# EAGLE design RAMPS (EAGLE 7.5.0)
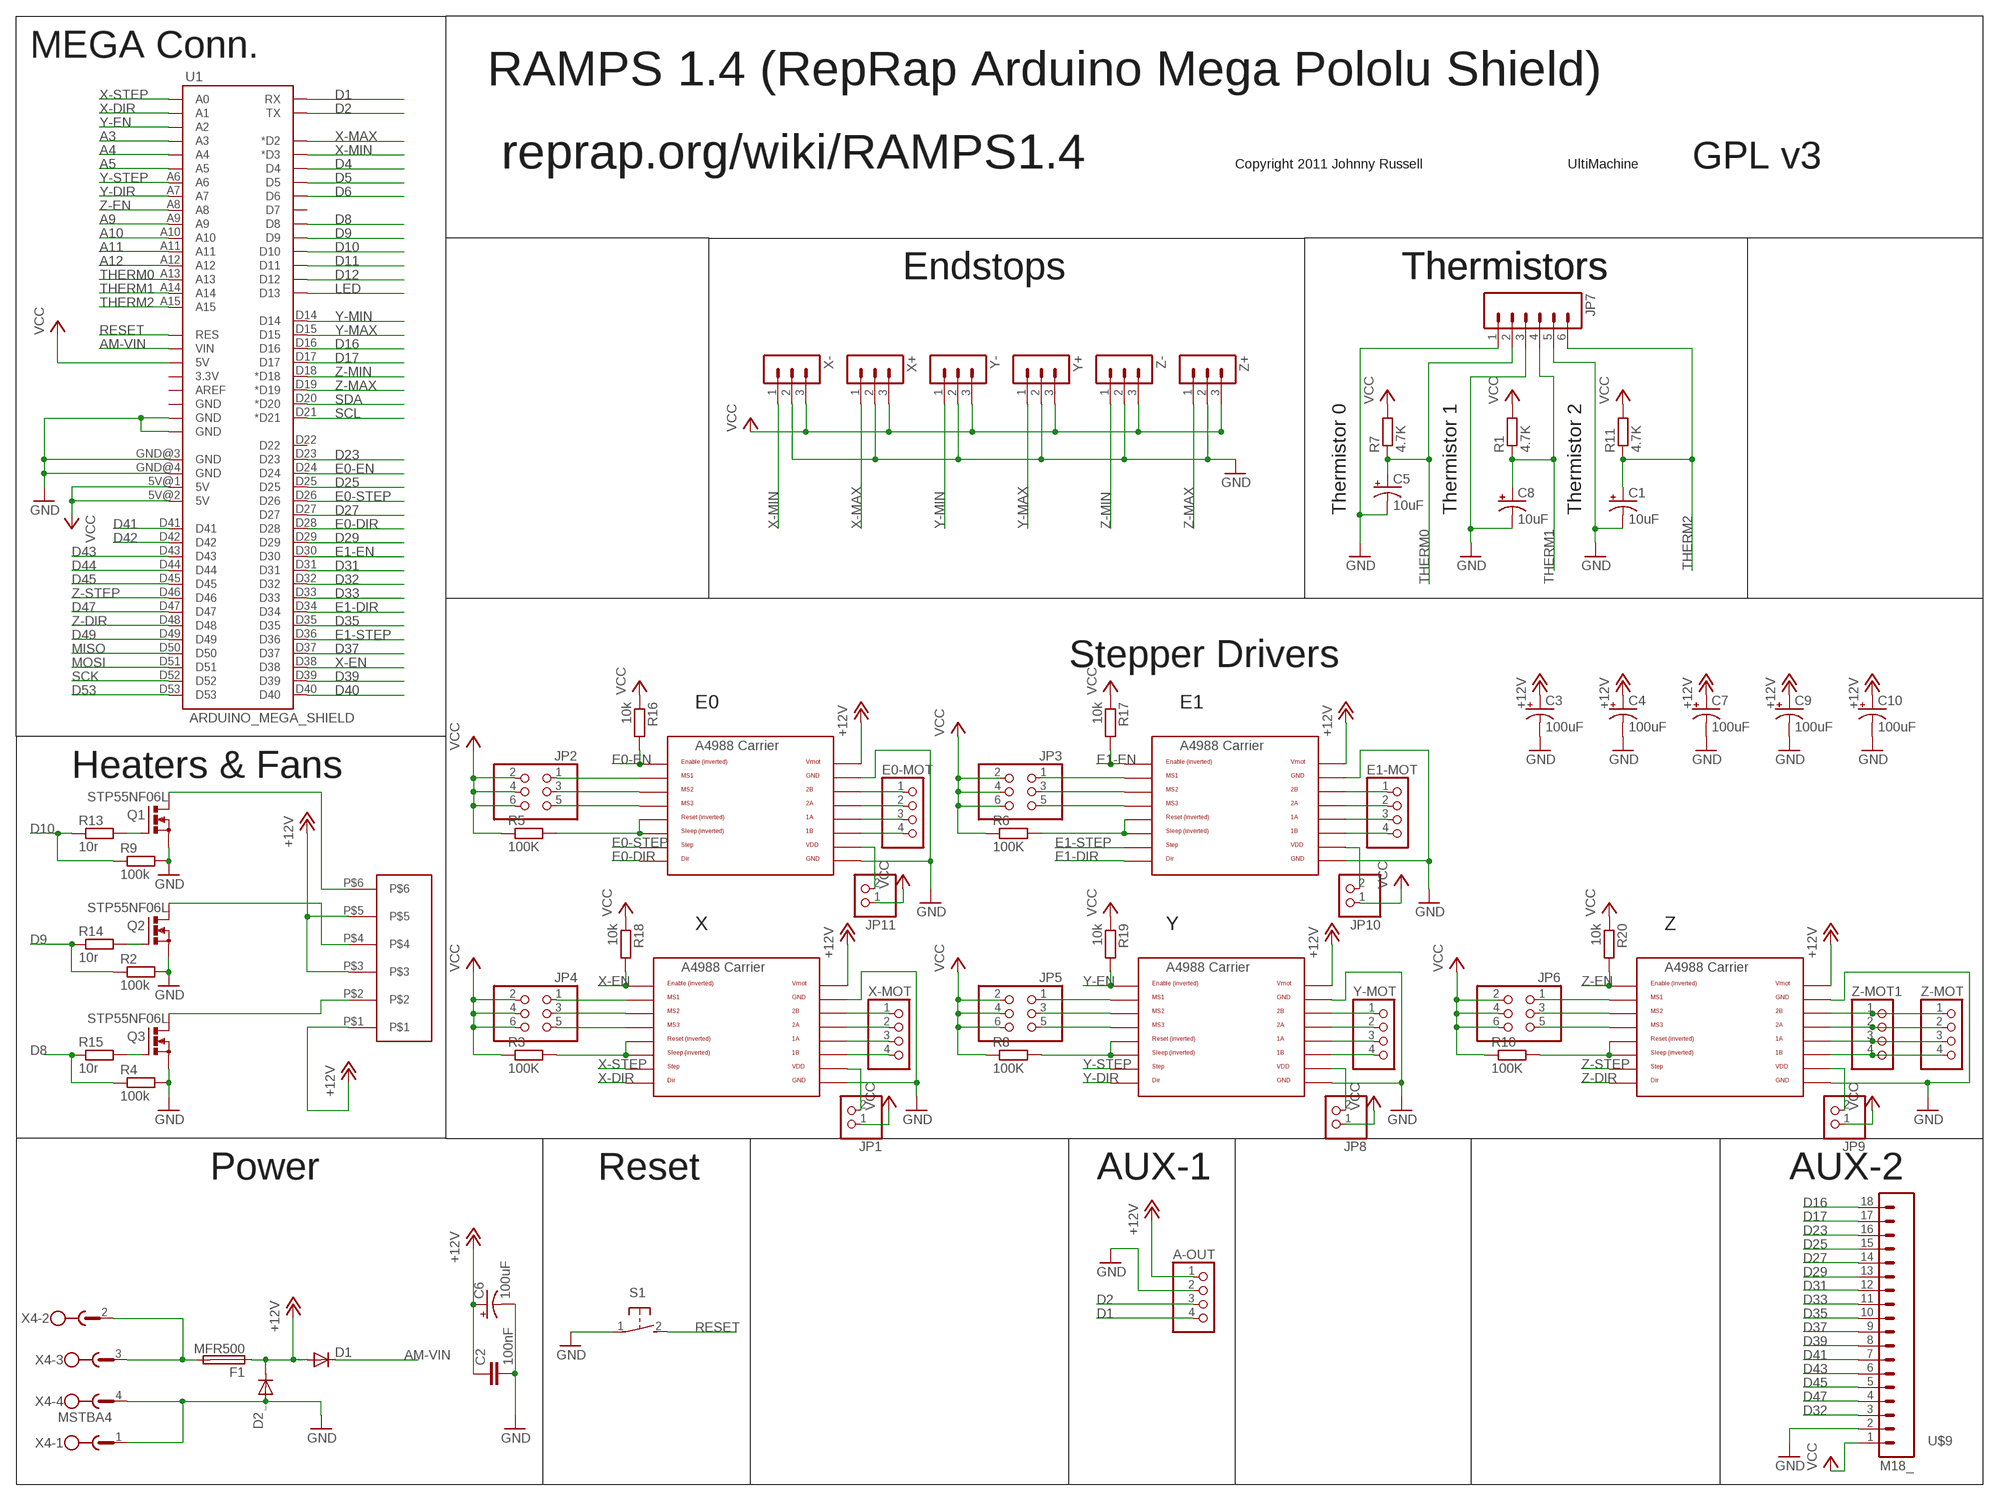
[diagram p0: schematic, sheet 1]

## Parts
A-OUT  PINHD-1X4  [1X04]
C1  10uF  CPOL-US153CLV-0405  [153CLV-0405]
C2  100nF  C-EUC0805  [C0805]
C3  100uF  CPOL-US153CLV-0605  [153CLV-0605]
C4  100uF  CPOL-US153CLV-0605  [153CLV-0605]
C5  10uF  CPOL-US153CLV-0405  [153CLV-0405]
C6  100uF  CPOL-US153CLV-0605  [153CLV-0605]
C7  100uF  CPOL-US153CLV-0605  [153CLV-0605]
C8  10uF  CPOL-US153CLV-0405  [153CLV-0405]
C9  100uF  CPOL-US153CLV-0605  [153CLV-0605]
C10  100uF  CPOL-US153CLV-0605  [153CLV-0605]
D1  DIODE-DO-214AC  [DO-214AC]
D2  DIODE-DO-214AC  [DO-214AC]
E0-MOT  PINHD-1X4  [1X04]
E1-MOT  PINHD-1X4  [1X04]
F1  MFR500  PTCFUSE  [MFR500]
JP1  PINHD-1X2  [1X02]
JP2  PINHD-2X3  [2X03]
JP3  PINHD-2X3  [2X03]
JP4  PINHD-2X3  [2X03]
JP5  PINHD-2X3  [2X03]
JP6  PINHD-2X3  [2X03]
JP7  M06SIP  [1X06]
JP8  PINHD-1X2  [1X02]
JP9  PINHD-1X2  [1X02]
JP10  PINHD-1X2  [1X02]
JP11  PINHD-1X2  [1X02]
Q1  STP55NF06L  IRF512  [TO220BV]
Q2  STP55NF06L  IRF512  [TO220BV]
Q3  STP55NF06L  IRF512  [TO220BV]
R1  4.7K  R-EU_R1206  [R1206]
R2  100k  R-EU_R0805  [R0805]
R3  100K  R-EU_R0805  [R0805]
R4  100k  R-EU_R0805  [R0805]
R5  100K  R-EU_R0805  [R0805]
R6  100K  R-EU_R0805  [R0805]
R7  4.7K  R-EU_R1206  [R1206]
R8  100K  R-EU_R0805  [R0805]
R9  100k  R-EU_R0805  [R0805]
R10  100K  R-EU_R0805  [R0805]
R11  4.7K  R-EU_R1206  [R1206]
R13  10r  R-EU_R0805  [R0805]
R14  10r  R-EU_R0805  [R0805]
R15  10r  R-EU_R0805  [R0805]
R16  10k  R-EU_R0805  [R0805]
R17  10k  R-EU_R0805  [R0805]
R18  10k  R-EU_R0805  [R0805]
R19  10k  R-EU_R0805  [R0805]
R20  10k  R-EU_R0805  [R0805]
S1  31-XX  [B3F-31XX]
U1  ARDUINO_MEGA_SHIELD  [ARDUINO_MEGA_SHIELD]
U$2  282837-6  [282837-6]
U$4  A4988BREAKOUT  [A4988BREAKOUT]
U$5  A4988BREAKOUT  [A4988BREAKOUT]
U$6  A4988BREAKOUT  [A4988BREAKOUT]
U$7  A4988BREAKOUT  [A4988BREAKOUT]
U$8  A4988BREAKOUT  [A4988BREAKOUT]
U$9  M18_  [1X18]
X4  MSTBA4  [MSTBA4]
X+  3PIN-HEADER  [3PIN-HEADER]
X-  3PIN-HEADER  [3PIN-HEADER]
X-MOT  PINHD-1X4  [1X04]
Y+  3PIN-HEADER  [3PIN-HEADER]
Y-  3PIN-HEADER  [3PIN-HEADER]
Y-MOT  PINHD-1X4  [1X04]
Z+  3PIN-HEADER  [3PIN-HEADER]
Z-  3PIN-HEADER  [3PIN-HEADER]
Z-MOT  PINHD-1X4  [1X04]
Z-MOT1  PINHD-1X4  [1X04]

## Nets
+12V: A-OUT.1 C2.1 C3.+ C4.+ C6.+ C7.+ C9.+ C10.+ D1.A D2.C F1.1 U$2.P$1 U$2.P$3 U$2.P$5 U$4.VMOT U$5.VMOT U$6.VMOT U$7.VMOT U$8.VMOT
A3: U1.A3
A4: U1.A4
A5: U1.A5
A9: U1.A9
A10: U1.A10
A11: U1.A11
A12: U1.A12
AM-VIN: D1.C U1.VIN
D1: A-OUT.4 U1.RX
D2: A-OUT.3 U1.TX
D4: U1.D4
D5: U1.D5
D6: U1.D6
D8: R4.1 R15.1 U1.D8
D9: R2.1 R14.1 U1.D9
D10: R9.1 R13.1 U1.D10
D11: U1.D11
D12: U1.D12
D16: U1.D16 U$9.18
D17: U1.D17 U$9.17
D23: U1.D23 U$9.16
D25: U1.D25 U$9.15
D27: U1.D27 U$9.14
D29: U1.D29 U$9.13
D31: U1.D31 U$9.12
D32: U1.D32 U$9.3
D33: U1.D33 U$9.11
D35: U1.D35 U$9.10
D37: U1.D37 U$9.9
D39: U1.D39 U$9.8
D40: U1.D40
D41: U1.D41 U$9.7
D42: U1.D42
D43: U1.D43 U$9.6
D44: U1.D44
D45: U1.D45 U$9.5
D47: U1.D47 U$9.4
D49: U1.D49
D53: U1.D53
E0-DIR: U1.D28 U$4.DIR
E0-EN: R16.2 U1.D24 U$4.EN
E0-STEP: U1.D26 U$4.STEP
E1-DIR: U1.D34 U$5.DIR
E1-EN: R17.2 U1.D30 U$5.EN
E1-STEP: U1.D36 U$5.STEP
GND: A-OUT.2 C1.- C2.2 C3.- C4.- C5.- C6.- C7.- C8.- C9.- C10.- D2.A JP7.1 JP7.3 JP7.5 Q1.S Q2.S Q3.S R2.2 R4.2 R9.2 S1.1(P) U1.GND@0(GND) U1.GND@1(GND) U1.GND@3(GND) U1.GND@4(GND) U$4.GND U$4.GND@0(GND) U$5.GND U$5.GND@0(GND) U$6.GND U$6.GND@0(GND) U$7.GND U$7.GND@0(GND) U$8.GND U$8.GND@0(GND) U$9.2 X4.1 X4.4 X+.2 X-.2 Y+.2 Y-.2 Z+.2 Z-.2
LED: U1.D13
MISO: U1.D50
MOSI: U1.D51
N$1: Q2.D U$2.P$4
N$2: F1.2 X4.2 X4.3
N$3: E0-MOT.1 U$4.2B
N$4: E0-MOT.2 U$4.2A
N$5: JP2.1 U$4.MS1
N$6: JP2.5 U$4.MS3
N$7: Q1.D U$2.P$6
N$8: R5.2 U$4.RST U$4.SLP(SLEEP)
N$9: JP2.3 U$4.MS2
N$10: E0-MOT.3 U$4.1A
N$11: E0-MOT.4 U$4.1B
N$12: E1-MOT.1 U$5.2B
N$13: E1-MOT.2 U$5.2A
N$14: JP4.1 U$6.MS1
N$15: JP4.3 U$6.MS2
N$16: E1-MOT.3 U$5.1A
N$17: JP5.3 U$7.MS2
N$18: E1-MOT.4 U$5.1B
N$19: JP4.5 U$6.MS3
N$20: R3.2 U$6.RST U$6.SLP(SLEEP)
N$21: U$6.2B X-MOT.1
N$22: U$6.2A X-MOT.2
N$23: R8.2 U$7.RST U$7.SLP(SLEEP)
N$24: R6.2 U$5.RST U$5.SLP(SLEEP)
N$25: JP3.1 U$5.MS1
N$26: U$6.1A X-MOT.3
N$27: U$6.1B X-MOT.4
N$28: U$7.2B Y-MOT.1
N$29: U$7.2A Y-MOT.2
N$30: U$7.1A Y-MOT.3
N$31: JP5.5 U$7.MS3
N$32: JP11.2 U$4.VDD
N$33: JP5.1 U$7.MS1
N$34: JP3.5 U$5.MS3
N$35: JP3.3 U$5.MS2
N$36: U$7.1B Y-MOT.4
N$37: JP6.3 U$8.MS2
N$38: R10.2 U$8.RST U$8.SLP(SLEEP)
N$39: JP6.5 U$8.MS3
N$40: JP6.1 U$8.MS1
N$41: U$8.2B Z-MOT1.1 Z-MOT.1
N$42: U$8.2A Z-MOT1.2 Z-MOT.2
N$43: U$8.1A Z-MOT1.3 Z-MOT.3
N$44: U$8.1B Z-MOT1.4 Z-MOT.4
N$45: JP1.2 U$6.VDD
N$46: JP8.2 U$7.VDD
N$47: Q2.G R14.2
N$48: Q1.G R13.2
N$49: Q3.G R15.2
N$50: JP9.2 U$8.VDD
N$51: Q3.D U$2.P$2
N$52: JP10.2 U$5.VDD
RESET: S1.2(S) U1.RES
SCK: U1.D52
SCL: U1.D21(*D21)
SDA: U1.D20(*D20)
THERM0: C5.+ JP7.2 R7.1 U1.A13
THERM1: C8.+ JP7.4 R1.1 U1.A14
THERM2: C1.+ JP7.6 R11.1 U1.A15
VCC: JP1.1 JP2.2 JP2.4 JP2.6 JP3.2 JP3.4 JP3.6 JP4.2 JP4.4 JP4.6 JP5.2 JP5.4 JP5.6 JP6.2 JP6.4 JP6.6 JP8.1 JP9.1 JP10.1 JP11.1 R1.2 R3.1 R5.1 R6.1 R7.2 R8.1 R10.1 R11.2 R16.1 R17.1 R18.1 R19.1 R20.1 U1.5V@0(5V) U1.5V@1(5V) U1.5V@2(5V) U$9.1 X+.3 X-.3 Y+.3 Y-.3 Z+.3 Z-.3
X-DIR: U1.A1 U$6.DIR
X-EN: R18.2 U1.D38 U$6.EN
X-MAX: U1.D2(*D2) X+.1
X-MIN: U1.D3(*D3) X-.1
X-STEP: U1.A0 U$6.STEP
Y-DIR: U1.A7 U$7.DIR
Y-EN: R19.2 U1.A2 U$7.EN
Y-MAX: U1.D15 Y+.1
Y-MIN: U1.D14 Y-.1
Y-STEP: U1.A6 U$7.STEP
Z-DIR: U1.D48 U$8.DIR
Z-EN: R20.2 U1.A8 U$8.EN
Z-MAX: U1.D19(*D19) Z+.1
Z-MIN: U1.D18(*D18) Z-.1
Z-STEP: U1.D46 U$8.STEP
Unconnected: U1.3.3V U1.AREF U1.D7 U1.D22 U1.GND@2(GND)

## Notes on the sheet
- MEGA Conn.
- RAMPS 1.4 (RepRap Arduino Mega Pololu Shield)
- reprap.org/wiki/RAMPS1.4 | Copyright 2011 Johnny Russell | UltiMachine | GPL v3
- Endstops | Thermistors | Thermistors
- Thermistor 0 | Thermistor 1 | Thermistor 2
- Stepper Drivers
- E0 | E1
- Heaters & Fans
- X | Y | Z
- Power | Reset | AUX-1 | AUX-2

## Library data of the parts
A-OUT E0-MOT E1-MOT X-MOT Y-MOT Z-MOT Z-MOT1 = RepRapjr:PINHD-1X4: PIN HEADER
C1 C3-C10 = adafruit:CPOL-US: POLARIZED CAPACITOR, American symbol
C2 = rcl:C-EU: CAPACITOR, European symbol
D1 D2 = diode:DIODE-: DIODE
F1 = RepRapjr:PTCFUSE: LITTLEFUSE Picofuse/slow Littlefuse
JP1 JP8-JP11 = pinhead:PINHD-1X2: PIN HEADER
JP2-JP6 = pinhead:PINHD-2X3: PIN HEADER
JP7 = SparkFun:M06: Header 6 Standard 6-pin 0.1" header. Use with straight break away headers (SKU : PRT-00116), right angle break away headers (PRT-00553), swiss pins (PRT-00743), machine pins (PRT-00117), and female headers (PRT-00115). Molex polarized connector foot print use with SKU : PRT-08094 with associated crimp pins and housings. NOTES ON THE VARIANTS LOCK and LOCK_LONGPADS... This footprint was designed to help hold the alignment of a through-hole component (i.e. 6-pin header) while soldering it into place. You may notice that each hole has been shifted either up or down by 0.005 of an inch from it's more standard position (which is a perfectly straight line). This slight alteration caused the pins (the squares in the middle) to touch the edges of the holes. Because they are alternating, it causes a "brace" to hold the component in place. 0.005 has proven to be the perfect amount of "off-center" position when using our standard breakaway headers. Although looks a little odd when you look at the bare footprint, once you have a header in there, the alteration is very hard to notice. Also, if you push a header all the way into place, it is covered up entirely on the bottom side. This idea of altering the position of holes to aid alignment will be further integrated into the Sparkfun Library for other footprints. It can help hold any component with 3 or more connection pins.
Q1-Q3 = transistor-power:IRF512: N-CHANNEL MOS FET
R1-R11 R13-R20 = rcl:R-EU_: RESISTOR, European symbol
S1 = switch-omron:31-XX: OMRON SWITCH; MPN: B3F-3100; OC_FARNELL: 959704; OC_NEWARK: 36M3582
U1 = RepRapjr:ARDUINO_MEGA_SHIELD
U$2 = RepRapjr:282837-6
U$4-U$8 = RepRapjr:A4988BREAKOUT
U$9 = SparkFun:M18
X4 = con-phoenix-508:MSTBA4: PHOENIX
X+ X- Y+ Y- Z+ Z- = ultimachine:3PIN-HEADER: PIN HEADER

## Board
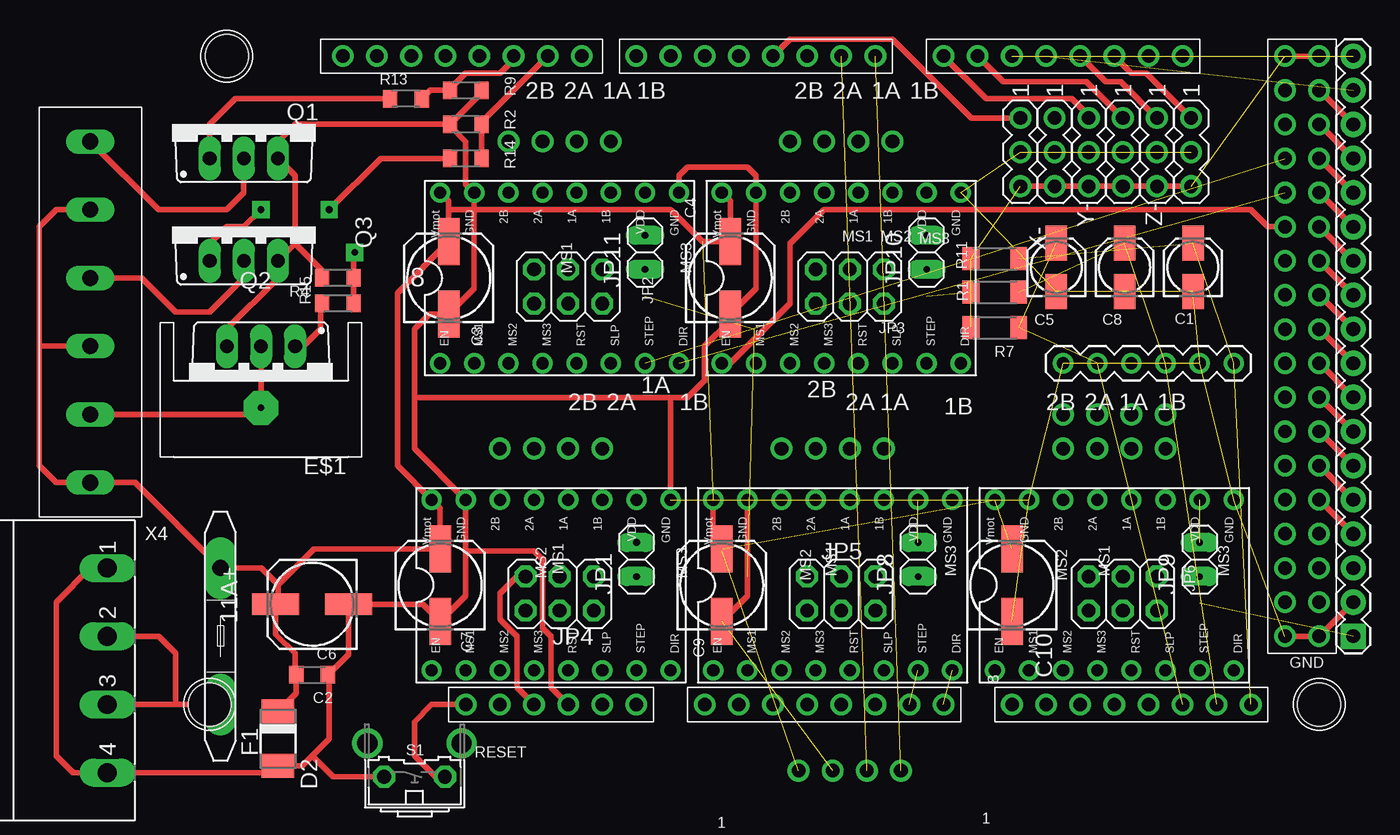
[diagram p1: board, top side]
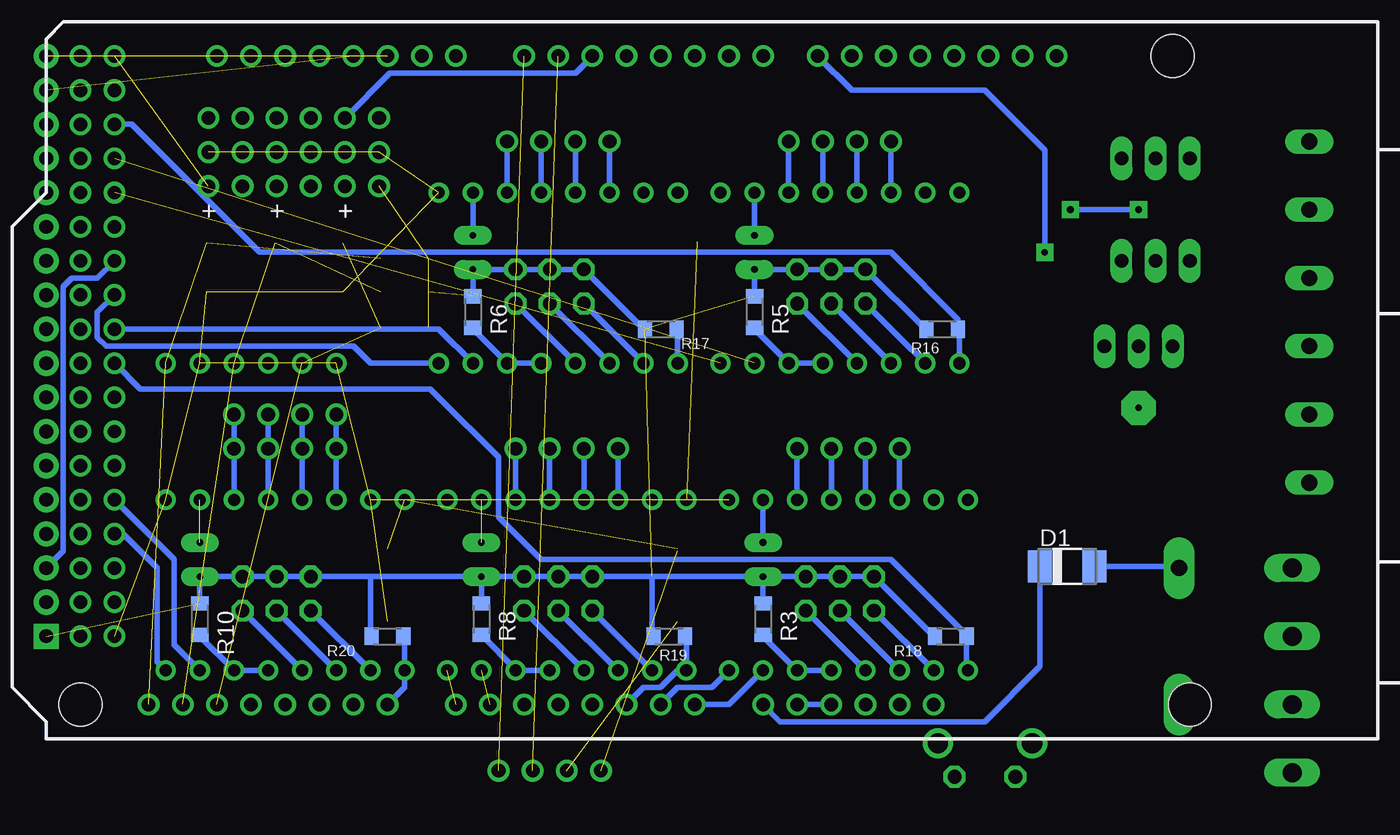
[diagram p2: board, bottom side, seen from below]

No outline drawn. Coordinates in mm, seen from the top.
Copper layers (1*16): Top 0.035mm / dielectric 1.5mm / Bottom 0.035mm
Design rules "GoldPhoenix": minimum track width 7mil, minimum drill 15mil, track to track 7mil, track to pad 7mil, pad to pad 7mil, via to via 7mil, smd to smd 7mil, copper to edge 10mil, drill to drill 8mil, minimum pad ring 12mil, minimum via ring 7mil, stop-mask expansion 4mil, vias tented up to drill 25mil, thermal gap 10mil

### Footprints (pad centres in the part's own frame; a part is rotated, then mirrored left to right if it is on the bottom)
1X04 = drill 1.016: 1 -2.54,0; 2 0,0; 3 2.54,0; 4 5.08,0
153CLV-0405 = smd 2.6 x 1.6: + 1.8,0; - -1.8,0
C0805 = smd 1.05 x 1.3: 1 -1.175,0; 2 1.175,0
153CLV-0605 = smd 3.5 x 1.6: + 2.7,0; - -2.7,0
DO-214AC = smd 1.8 x 2.4: A 2.025,0; C -2.025,0
SK95-3M3 = drill 0.5 pad 2.54 octagon: P$1 0,2.05
MFR500 = drill 1.2 pad 2.3 long: 1 -5.08,0; 2 5.08,0
1X02 = drill 0.5 pad 1.422 long: 1 -1.27,0; 2 1.27,0
2X03 = drill 1.016 octagon: 1 -2.54,-1.27; 2 -2.54,1.27; 3 0,-1.27; 4 0,1.27; 5 2.54,-1.27; 6 2.54,1.27
1X06 = drill 0.9 pad 1.422: 1 0,0; 2 2.54,0; 3 5.08,0; 4 7.62,0; 5 10.16,0; 6 12.7,0
TO220BV = drill 1.016 long: D 0,-2.54; G -2.54,-2.54; S 2.54,-2.54
R1206 = smd 1.25 x 1.7: 1 -1.775,0; 2 1.775,0
R0805 = smd 1.05 x 1.3: 1 -1.175,0; 2 1.175,0
B3F-31XX = drill 1.016 octagon: 1 -2.261,-1.245; 2 2.261,-1.245 | drill 1.499 pad 2.159: 3 -3.505,1.245; 4 3.505,1.245
ARDUINO_MEGA_SHIELD = drill 1 pad 1.422: 3.3V 35.56,2.54; 5V@0 38.1,2.54; 5V@1 93.98,50.8; 5V@2 96.52,50.8; A0 50.8,2.54; A1 53.34,2.54; A2 55.88,2.54; A3 58.42,2.54; A4 60.96,2.54; A5 63.5,2.54; A6 66.04,2.54; A7 68.58,2.54; A8 73.66,2.54; A9 76.2,2.54; A10 78.74,2.54; A11 81.28,2.54; A12 83.82,2.54; A13 86.36,2.54; A14 88.9,2.54; A15 91.44,2.54; AREF 23.876,50.8; D2 58.42,50.8; D3 55.88,50.8; D4 53.34,50.8; D5 50.8,50.8; D6 48.26,50.8; D7 45.72,50.8; D8 41.656,50.8; D9 39.116,50.8; D10 36.576,50.8; D11 34.036,50.8; D12 31.496,50.8; D13 28.956,50.8; D14 68.58,50.8; D15 71.12,50.8; D16 73.66,50.8; D17 76.2,50.8; D18 78.74,50.8; D19 81.28,50.8; D20 83.82,50.8; D21 86.36,50.8; D22 93.98,48.26; D23 96.52,48.26; D24 93.98,45.72; D25 96.52,45.72; D26 93.98,43.18; D27 96.52,43.18; D28 93.98,40.64; D29 96.52,40.64; D30 93.98,38.1; D31 96.52,38.1; D32 93.98,35.56; D33 96.52,35.56; D34 93.98,33.02; D35 96.52,33.02; D36 93.98,30.48; D37 96.52,30.48; D38 93.98,27.94; D39 96.52,27.94; D40 93.98,25.4; D41 96.52,25.4; D42 93.98,22.86; D43 96.52,22.86; D44 93.98,20.32; D45 96.52,20.32; D46 93.98,17.78; D47 96.52,17.78; D48 93.98,15.24; D49 96.52,15.24; D50 93.98,12.7; D51 96.52,12.7; D52 93.98,10.16; D53 96.52,10.16; GND@0 40.64,2.54; GND@1 43.18,2.54; GND@2 26.416,50.8; GND@3 93.98,7.62; GND@4 96.52,7.62; RES 33.02,2.54; RX 63.5,50.8; TX 60.96,50.8; VIN 45.72,2.54 | hole 3.2: 96.52,2.54; 13.97,2.54; 15.24,50.8
282837-6 = drill 1.2 long: P$1 0,-12.7; P$2 0,-7.62; P$3 0,-2.54; P$4 0,2.54; P$5 0,7.62; P$6 0,12.7
A4988BREAKOUT = drill 0.9: 1A 8.89,1.27; 1B 11.43,1.27; 2A 6.35,1.27; 2B 3.81,1.27; DIR 16.51,-11.43; EN -1.27,-11.43; GND 16.51,1.27; GND@0 1.27,1.27; MS1 1.27,-11.43; MS2 3.81,-11.43; MS3 6.35,-11.43; RST 8.89,-11.43; SLP 11.43,-11.43; STEP 13.97,-11.43; VDD 13.97,1.27; VMOT -1.27,1.27
1X18 = drill 1.016 pad 1.88 square: 1 0,0 | drill 1.016 pad 1.88: 2 2.54,0; 3 5.08,0; 4 7.62,0; 5 10.16,0; 6 12.7,0; 7 15.24,0; 8 17.78,0; 9 20.32,0; 10 22.86,0; 11 25.4,0; 12 27.94,0; 13 30.48,0; 14 33.02,0; 15 35.56,0; 16 38.1,0; 17 40.64,0; 18 43.18,0
MSTBA4 = drill 1.397 long: 1 -7.62,5.08; 2 -2.54,5.08; 3 2.54,5.08; 4 7.62,5.08
3PIN-HEADER = drill 1.016: 1 -2.54,0; 2 0,0; 3 2.54,0

### Placement (x,y rotation side)
A-OUT  60.33,12.86 0 top
C1  87.12,50.32 90 top
C2  21.59,20 0 top
C3  31.75,49.53 90 top
C4  52.7,49.53 90 top
C5  76.96,50.32 90 top
C6  21.59,25.24 180 top
C7  31.11,26.67 90 top
C8  82.04,50.32 90 top
C9  52.07,26.67 90 top
C10  73.66,26.67 90 top
D1  23.09,28.07 0 bottom
D2  19.05,15.24 270 top
E0-MOT  38.73,59.69 0 top
E1-MOT  59.69,59.69 0 top
E$1  [SK95-3M3]  17.78,41.91 180 top
F1  14.76,22.86 270 top
JP1  45.72,28.57 90 top
JP2  40.64,48.9 0 top
JP3  61.59,48.9 0 top
JP4  40.01,26.04 0 top
JP5  60.96,26.04 0 top
JP6  81.92,26.04 0 top
JP7  77.47,43.18 0 top
JP8  66.67,28.57 90 top
JP9  87.63,28.57 90 top
JP10  67.31,51.44 90 top
JP11  46.35,51.44 90 top
Q1  16.51,60.96 0 top
Q2  16.51,53.34 0 top
Q3  17.78,41.91 180 top
R1  72.39,48.47 180 top
R2  33.02,60.96 180 top
R3  45.72,24.13 270 bottom
R4  23.5,49.53 180 top
R5  46.35,46.99 270 bottom
R6  67.31,46.99 270 bottom
R7  72.39,45.83 180 top
R8  66.67,24.13 270 bottom
R9  33.02,63.5 0 top
R10  87.63,24.13 270 bottom
R11  72.39,50.96 180 top
R13  28.57,62.87 180 top
R14  33.02,58.42 180 top
R15  23.5,47.62 180 top
R16  32.38,45.72 0 bottom
R17  53.34,45.72 0 bottom
R18  31.75,22.86 0 bottom
R19  52.7,22.86 0 bottom
R20  73.66,22.86 0 bottom
S1  29.21,13.65 0 top
U1  0,15.24 0 top
U$2  5.08,46.99 0 top
U$4  32.38,54.61 0 top
U$5  53.34,54.61 0 top
U$6  31.75,31.75 0 top
U$7  52.7,31.75 0 top
U$8  73.66,31.75 0 top
U$9  99.06,22.86 90 top
X4  1.27,20.32 270 top
X+  76.83,58.9 270 top
X-  74.3,58.9 270 top
X-MOT  38.1,36.83 0 top
Y+  81.92,58.9 270 top
Y-  79.38,58.9 270 top
Y-MOT  59.05,36.83 180 bottom
Z+  87,58.9 270 top
Z-  84.45,58.9 270 top
Z-MOT  80.01,39.37 0 top
Z-MOT1  80.01,36.83 0 top

### Tracks (layer width: path | path; a pad name or v marks a point on that pad's centre or on a via)
+12V  (4 unrouted)
  Top 0.406: 1.27,44.45 1.27,35.56 2.54,34.29 U$2.P$1 8.41,34.29 F1.1 17.78,27.94 19.05,26.67 | 1.27,44.45 2.54,44.45 U$2.P$3 | U$2.P$5 2.54,54.61 1.27,53.34 1.27,44.45 | U$4.VMOT 31.75,55.24 31.75,54.61 | 31.75,54.61 C3.+ | C3.+ 31.75,52.07 C3.+ | U$5.VMOT 52.7,55.24 C4.+ 50.64,52.23 48.26,54.61 31.75,54.61 | C9.+ 51.44,30 U$7.VMOT 51.44,29.84 52.07,29.21 | 19.05,26.67 19.05,25.4 C6.+ 18.89,23.02 20.32,21.59 20.32,20.1 C2.1 20.41,18.63 D2.C | 19.05,26.67 21.75,29.37 C7.+ 31.11,32.38 U$6.VMOT 27.94,35.56 27.94,48.42 C3.+
  Bottom 0.406: D1.A 14.64,28.07 14.37,28.34 F1.1
AM-VIN
  Bottom 0.406: D1.C 25.11,20.61 29.21,16.51 44.45,16.51 U1.VIN
D1  (1 unrouted)
D2  (1 unrouted)
D8  (via drill 0.5 pad 1.27)
  Top 0.406: R4.1 24.67,48.9 | 24.67,48.9 R15.1 | v24.77,51.44 24.67,51.34 24.67,48.9
  Bottom 0.406: U1.D8 39.12,63.5 29.21,63.5 24.77,59.05 v24.77,51.44
D9
  Top 0.406: U1.D9 34.2,61.12 R2.1 R14.1
D10
  Top 0.406: U1.D10 36.58,65.79 35.56,64.77 33.02,64.77 31.75,63.5 R9.1 30.39,63.5 R13.1
D16  (1 unrouted)
D17  (1 unrouted)
D23
  Top 0.406: U1.D23 U$9.16
D25
  Top 0.406: U1.D25 U$9.15
D27
  Top 0.406: U1.D27 U$9.14
D29
  Top 0.406: U1.D29 U$9.13
D31
  Top 0.406: U1.D31 U$9.12
D32
  Bottom 0.406: U$9.3 97.79,29.21 97.79,48.9 97.16,49.53 95.25,49.53 U1.D32
D33
  Top 0.406: U1.D33 U$9.11
D35
  Top 0.406: U$9.10 U1.D35
D37
  Top 0.406: U1.D37 U$9.9
D39
  Top 0.406: U$9.8 U1.D39
D41
  Top 0.406: U1.D41 U$9.7
D43
  Top 0.406: U$9.6 U1.D43
D45
  Top 0.406: U1.D45 U$9.5
D47
  Top 0.406: U$9.4 U1.D47
E0-DIR  (1 unrouted)
E0-EN
  Bottom 0.406: U$4.EN 31.11,45.62 R16.2 31.21,46.45 36.2,51.44 83.19,51.44 92.71,60.96 U1.D24
E0-STEP  (1 unrouted)
E1-DIR
  Bottom 0.406: U$5.DIR 74.93,43.18 76.2,44.45 94.61,44.45 95.25,45.09 95.25,46.99 U1.D34
E1-EN
  Top 0.406: U1.D30 92.71,53.34 91.44,54.61 59.69,54.61 57.15,52.07 57.15,48.26 57.15,47.62 52.7,43.18 U$5.EN
  Bottom 0.406: U$5.EN 52.07,45.62 R17.2
E1-STEP
  Bottom 0.406: U$5.STEP 69.85,45.72 U1.D36
GND  (20 unrouted)
  Top 0.406: X4.1 5.08,27.94 2.54,25.4 2.54,13.97 3.81,12.7 X4.4 18.54,12.7 D2.A 20.84,13.21 21.59,13.97 | 21.59,13.97 22.86,15.24 22.86,19.91 C2.2 24.29,21.53 C6.- 29.84,25.24 C7.- 33.02,25.88 33.02,29.21 | S1.1 23.15,12.41 21.59,13.97 | R9.2 34.2,63.31 R2.2 | R2.2 20.32,60.96 19.05,59.69 Q1.S 20.32,57.15 20.32,52.07 | 20.32,52.07 Q2.S 19.05,49.53 15.24,45.72 Q3.S | U$9.2 U1.GND@4 U1.GND@3 | R4.2 22.32,50.07 20.32,52.07 | R2.2 31.84,60.87 33.02,59.69 33.02,56.52 U$4.GND@0 33.66,48.73 C3.- 30.32,46.83 29.21,45.72 29.21,40.64 | U$4.GND 48.9,57.15 49.53,57.78 53.98,57.78 54.61,57.15 U$5.GND@0 54.61,48.73 C4.- 52.7,46.35 50.8,44.45 50.8,41.91 49.53,40.64 48.26,40.64 | 33.02,29.21 U$6.GND@0 29.21,36.83 29.21,40.64 | U$7.GND@0 53.98,25.88 C9.- | U1.GND@0 39.37,19.05 39.37,22.86 38.73,23.5 38.73,28.57 38.1,29.21 33.02,29.21 | 48.26,40.64 29.21,40.64 | U$6.GND 48.26,40.64
  Bottom 0.406: U1.GND@1 U1.GND@0
N$1
  Top 0.406: Q2.D 16.51,49.53 13.97,46.99 11.43,46.99 8.89,49.53 U$2.P$4
N$2
  Top 0.406: F1.2 X4.3 11.43,17.78 11.43,21.59 10.16,22.86 X4.2
N$3
  Bottom 0.406: E0-MOT.1 U$4.2B | U$4.2B
N$4
  Bottom 0.406: E0-MOT.2 U$4.2A | U$4.2A
N$5
  Bottom 0.406: JP2.1 35.56,45.09 U$4.MS1
N$6
  Bottom 0.406: U$4.MS3 JP2.5
N$7
  Top 0.406: Q1.D 16.51,55.88 15.24,54.61 10.16,54.61 U$2.P$6
N$8
  Bottom 0.406: U$4.RST U$4.SLP 46.45,45.81 R5.2
N$9
  Bottom 0.406: JP2.3 38.1,45.09 U$4.MS2
N$10
  Bottom 0.406: E0-MOT.3 U$4.1A | U$4.1A
N$11
  Bottom 0.406: E0-MOT.4 U$4.1B | U$4.1B
N$12
  Bottom 0.406: E1-MOT.1 U$5.2B
N$13
  Bottom 0.406: E1-MOT.2 U$5.2A
N$14
  Bottom 0.406: JP4.1 U$6.MS1
N$15
  Bottom 0.406: U$6.MS2 JP4.3
N$16
  Bottom 0.406: E1-MOT.3 U$5.1A
N$17
  Bottom 0.406: JP5.3 U$7.MS2
N$18
  Bottom 0.406: E1-MOT.4 U$5.1B
N$19
  Bottom 0.406: JP4.5 U$6.MS3
N$20
  Bottom 0.406: R3.2 45.72,22.86 U$6.SLP U$6.RST
N$21
  Bottom 0.406: X-MOT.1 U$6.2B
N$22
  Bottom 0.406: X-MOT.2 U$6.2A
N$23
  Bottom 0.406: U$7.RST U$7.SLP 64.14,20.41 R8.2
N$24
  Bottom 0.406: R6.2 67.31,45.72 U$5.SLP U$5.RST
N$25
  Bottom 0.406: JP3.1 U$5.MS1
N$26
  Bottom 0.406: X-MOT.3 U$6.1A
N$27
  Bottom 0.406: X-MOT.4 U$6.1B
N$28
  Bottom 0.406: U$7.2B Y-MOT.1
N$29
  Bottom 0.406: Y-MOT.2 U$7.2A
N$30
  Bottom 0.406: Y-MOT.3 U$7.1A
N$31
  Bottom 0.406: JP5.5 U$7.MS3
N$32
  Bottom 0.406: U$4.VDD 46.35,53.34 JP11.2
N$33
  Bottom 0.406: JP5.1 U$7.MS1
N$34
  Bottom 0.406: U$5.MS3 JP3.5
N$35
  Bottom 0.406: JP3.3 U$5.MS2
N$36
  Bottom 0.406: Y-MOT.4 U$7.1B
N$37
  Bottom 0.406: JP6.3 U$8.MS2
N$38
  Bottom 0.406: R10.2 87.63,22.86 U$8.SLP U$8.RST
N$39
  Bottom 0.406: U$8.MS3 JP6.5
N$40
  Bottom 0.406: U$8.MS1 JP6.1
N$41
  Bottom 0.406: U$8.2B Z-MOT1.1 Z-MOT.1
N$42
  Bottom 0.406: U$8.2A Z-MOT1.2 Z-MOT.2
N$43
  Bottom 0.406: U$8.1A Z-MOT1.3 Z-MOT.3
N$44
  Bottom 0.406: U$8.1B Z-MOT1.4 Z-MOT.4
N$45
  Bottom 0.406: JP1.2 U$6.VDD
N$46  (1 unrouted)
N$47  (via drill 0.5 pad 1.27)
  Top 0.406: Q2.G 13.97,52.07 15.24,53.34 16.51,53.34 v17.78,54.61 | v22.86,54.61 26.67,58.42 R14.2
  Bottom 0.406: v17.78,54.61 v22.86,54.61
N$48
  Top 0.406: Q1.G 13.97,60.96 15.88,62.87 R13.2
N$49
  Top 0.406: Q3.G 20.95,44.45 22.23,45.72 22.23,47.53 R15.2
N$50  (1 unrouted)
N$51
  Top 0.406: U$2.P$2 17.46,39.37 17.78,39.69 Q3.D
N$52
  Bottom 0.406: U$5.VDD 67.31,53.98 JP10.2
RESET
  Top 0.406: S1.2 30.77,12.41 29.21,13.97 29.21,16.51 30.48,17.78 U1.RES
THERM0  (3 unrouted)
THERM1  (3 unrouted)
THERM2  (3 unrouted)
VCC  (8 unrouted)
  Top 0.406: U1.5V@1 U1.5V@2 | X-.3 X+.3 Y-.3 Y+.3 Z-.3 Z+.3 | U1.5V@0 36.83,19.05 36.83,22.86 36.2,23.5 35.56,24.13 35.56,26.04 36.83,27.3 JP4.2
  Bottom 0.406: R5.1 JP11.1 JP2.6 JP2.4 JP2.2 33.66,45.72 R16.1 | 63.5,50.16 JP3.4 JP3.2 54.61,45.72 R17.1 | 63.5,50.16 JP3.6 | 63.5,50.16 JP10.1 R6.1 | R18.1 33.02,22.86 JP4.2 JP4.4 JP4.6 JP1.1 | JP1.1 R3.1 JP1.1 | R19.1 53.98,22.86 53.98,27.3 | JP8.1 JP5.6 JP5.4 JP5.2 53.98,27.3 | JP8.1 R8.1 JP8.1 | R20.1 74.93,22.86 74.93,27.3 | R10.1 JP9.1 JP6.6 JP6.4 JP6.2 74.93,27.3 | JP1.1 53.98,27.3 | JP8.1 74.93,27.3
X-DIR
  Bottom 0.406: U1.A1 52.07,19.05 50.8,19.05 49.53,19.05 U$6.DIR
X-EN
  Bottom 0.406: U$6.EN 30.57,20.41 R18.2 30.57,22.95 36.2,28.57 62.23,28.57 65.41,31.75 65.41,36.2 69.85,40.64 70.48,41.27 92.08,41.27 U1.D38
X-MAX
  Bottom 0.406: U1.D2 59.69,64.77 73.5,64.77 X+.1
X-MIN
  Top 0.406: X-.1 70.64,61.44 64.77,67.31 57.15,67.31 U1.D3
X-STEP
  Bottom 0.406: U$6.STEP 48.26,17.78 U1.A0
Y-DIR  (1 unrouted)
Y-EN
  Bottom 0.406: R19.2 51.44,22.77 U$7.EN 52.07,20.32 53.34,19.05 54.61,19.05 U1.A2
Y-MAX
  Top 0.406: U1.D15 73.03,64.14 79.22,64.14 Y+.1
Y-MIN
  Top 0.406: Y-.1 79.38,61.59 78.11,62.87 71.75,62.87 U1.D14
Y-STEP  (1 unrouted)
Z-DIR
  Bottom 0.406: U1.D48 93.34,30.48 90.81,27.94 90.81,20.95 U$8.DIR
Z-EN
  Bottom 0.406: R20.2 72.39,22.77 U$8.EN 72.39,19.05 U1.A8
Z-MAX
  Top 0.406: U1.D19 82.55,64.77 83.66,64.77 Z+.1
Z-MIN
  Top 0.406: U1.D18 80.64,64.14 81.76,64.14 Z-.1
Z-STEP
  Bottom 0.406: U$8.STEP 89.53,22.23 89.53,28.57 U1.D46

### Text on the board
tNames: 2B | 2A | 1A | 1B | 2B | 2A | 1A | 1B | MS1 | MS2 | MS3 | MS1 | MS3 | 8 | 1A | 2B | 2B | 2A | 1B | 2A | 1A | 2B | 2A | 1A | 1B | 1B | MS2 | MS1 | MS3 | MS2 | MS1 | MS3 | MS2 | MS1 | MS3 | 11A+ | GND | 8 | RESET | 1 | 1
bNames: + | + | + | +
Document: RAMPS 1.4 (RepRap Arduino MEGA Pololu Shield) | GPL v3 | reprap.org/wiki/RAMPS1.4 | Reversing input power, and inserting stepper drivers incorrectly will destroy electronics.
_tsilk: + | I2C | END STOPS | 21 | + | E0 | 1 | S | 20 | D10 | 1 | - | - | E1 | + | + | + | D9 | T0 | T1 | T2 | + | 1 | + | D8 | 1 | 1 | 1 | U | X | Y | Z | + | + | - | 1 | + | PS | AUX-4 | AUX-1 | AUX-2 | AUX-3 | + | - | s | s | 1 | - | + | UltiMachine | 1 | SERVOS | 1 | reprap.org/wiki/RAMPS | V1.4 | -